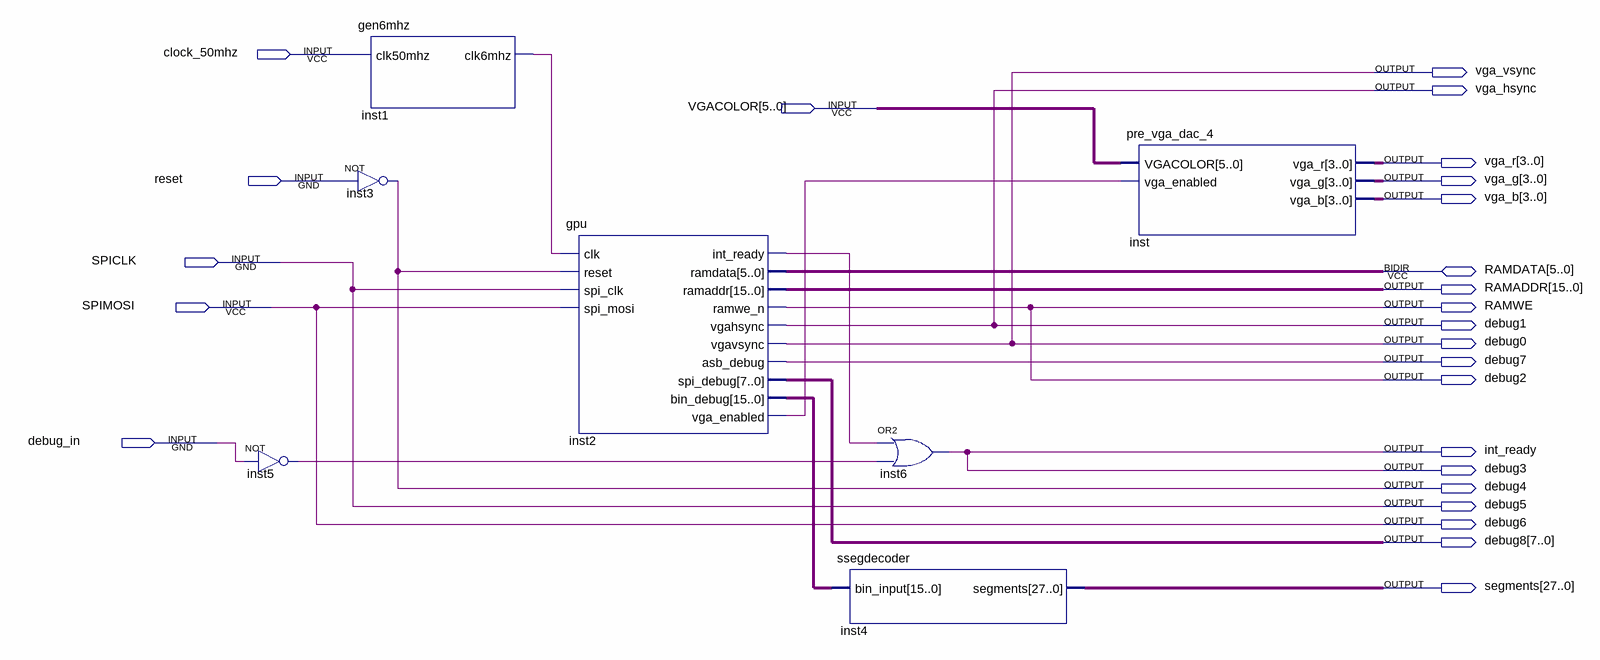
[diagram p0: schematic sheet]
// Quartus schematic top_de1.bdf as structural Verilog: 7 symbols, 25 pins
module top_de1 (
  input  clock_50mhz,
  input  [5:0] VGACOLOR,
  input  reset,
  input  SPICLK,
  input  SPIMOSI,
  input  debug_in,
  inout  [5:0] RAMDATA,
  output vga_vsync,
  output vga_hsync,
  output [3:0] vga_r,
  output [3:0] vga_g,
  output [3:0] vga_b,
  output [15:0] RAMADDR,
  output RAMWE,
  output debug1,
  output debug0,
  output debug7,
  output debug2,
  output int_ready,
  output debug3,
  output debug4,
  output debug5,
  output debug6,
  output [7:0] debug8,
  output [27:0] segments
);

  wire inst1_clk6mhz, inst2_int_ready, inst2_vga_enabled, inst5_out;
  wire [15:0] inst2_bin_debug;

  not inst5 (inst5_out, debug_in);
  gen6mhz inst1 (.clk50mhz(clock_50mhz), .clk6mhz(inst1_clk6mhz));
  not inst3 (debug4, reset);
  gpu inst2 (
    .clk(inst1_clk6mhz), .reset(debug4), .spi_clk(SPICLK), .spi_mosi(SPIMOSI), .int_ready(inst2_int_ready),
    .ramaddr(RAMADDR), .ramwe_n(debug2), .vgahsync(debug1), .vgavsync(debug0), .asb_debug(debug7),
    .spi_debug(debug8), .bin_debug(inst2_bin_debug), .vga_enabled(inst2_vga_enabled), .ramdata(RAMDATA));
  or inst6 (debug3, inst2_int_ready, inst5_out);
  ssegdecoder inst4 (.bin_input(inst2_bin_debug), .segments(segments));
  pre_vga_dac_4 inst (
    .VGACOLOR(VGACOLOR), .vga_enabled(inst2_vga_enabled), .vga_r(vga_r), .vga_g(vga_g), .vga_b(vga_b));

  assign debug5 = SPICLK;
  assign debug6 = SPIMOSI;
  assign int_ready = debug3;
  assign RAMWE = debug2;
  assign vga_hsync = debug1;
  assign vga_vsync = debug0;
endmodule
